# EasyEDA Pro project 数控电源_V3.eprj, schematic 电源板, sheet 2 of 2

## Sheets
2 电源板3: Page Name: 电源板3; Version: V0.32
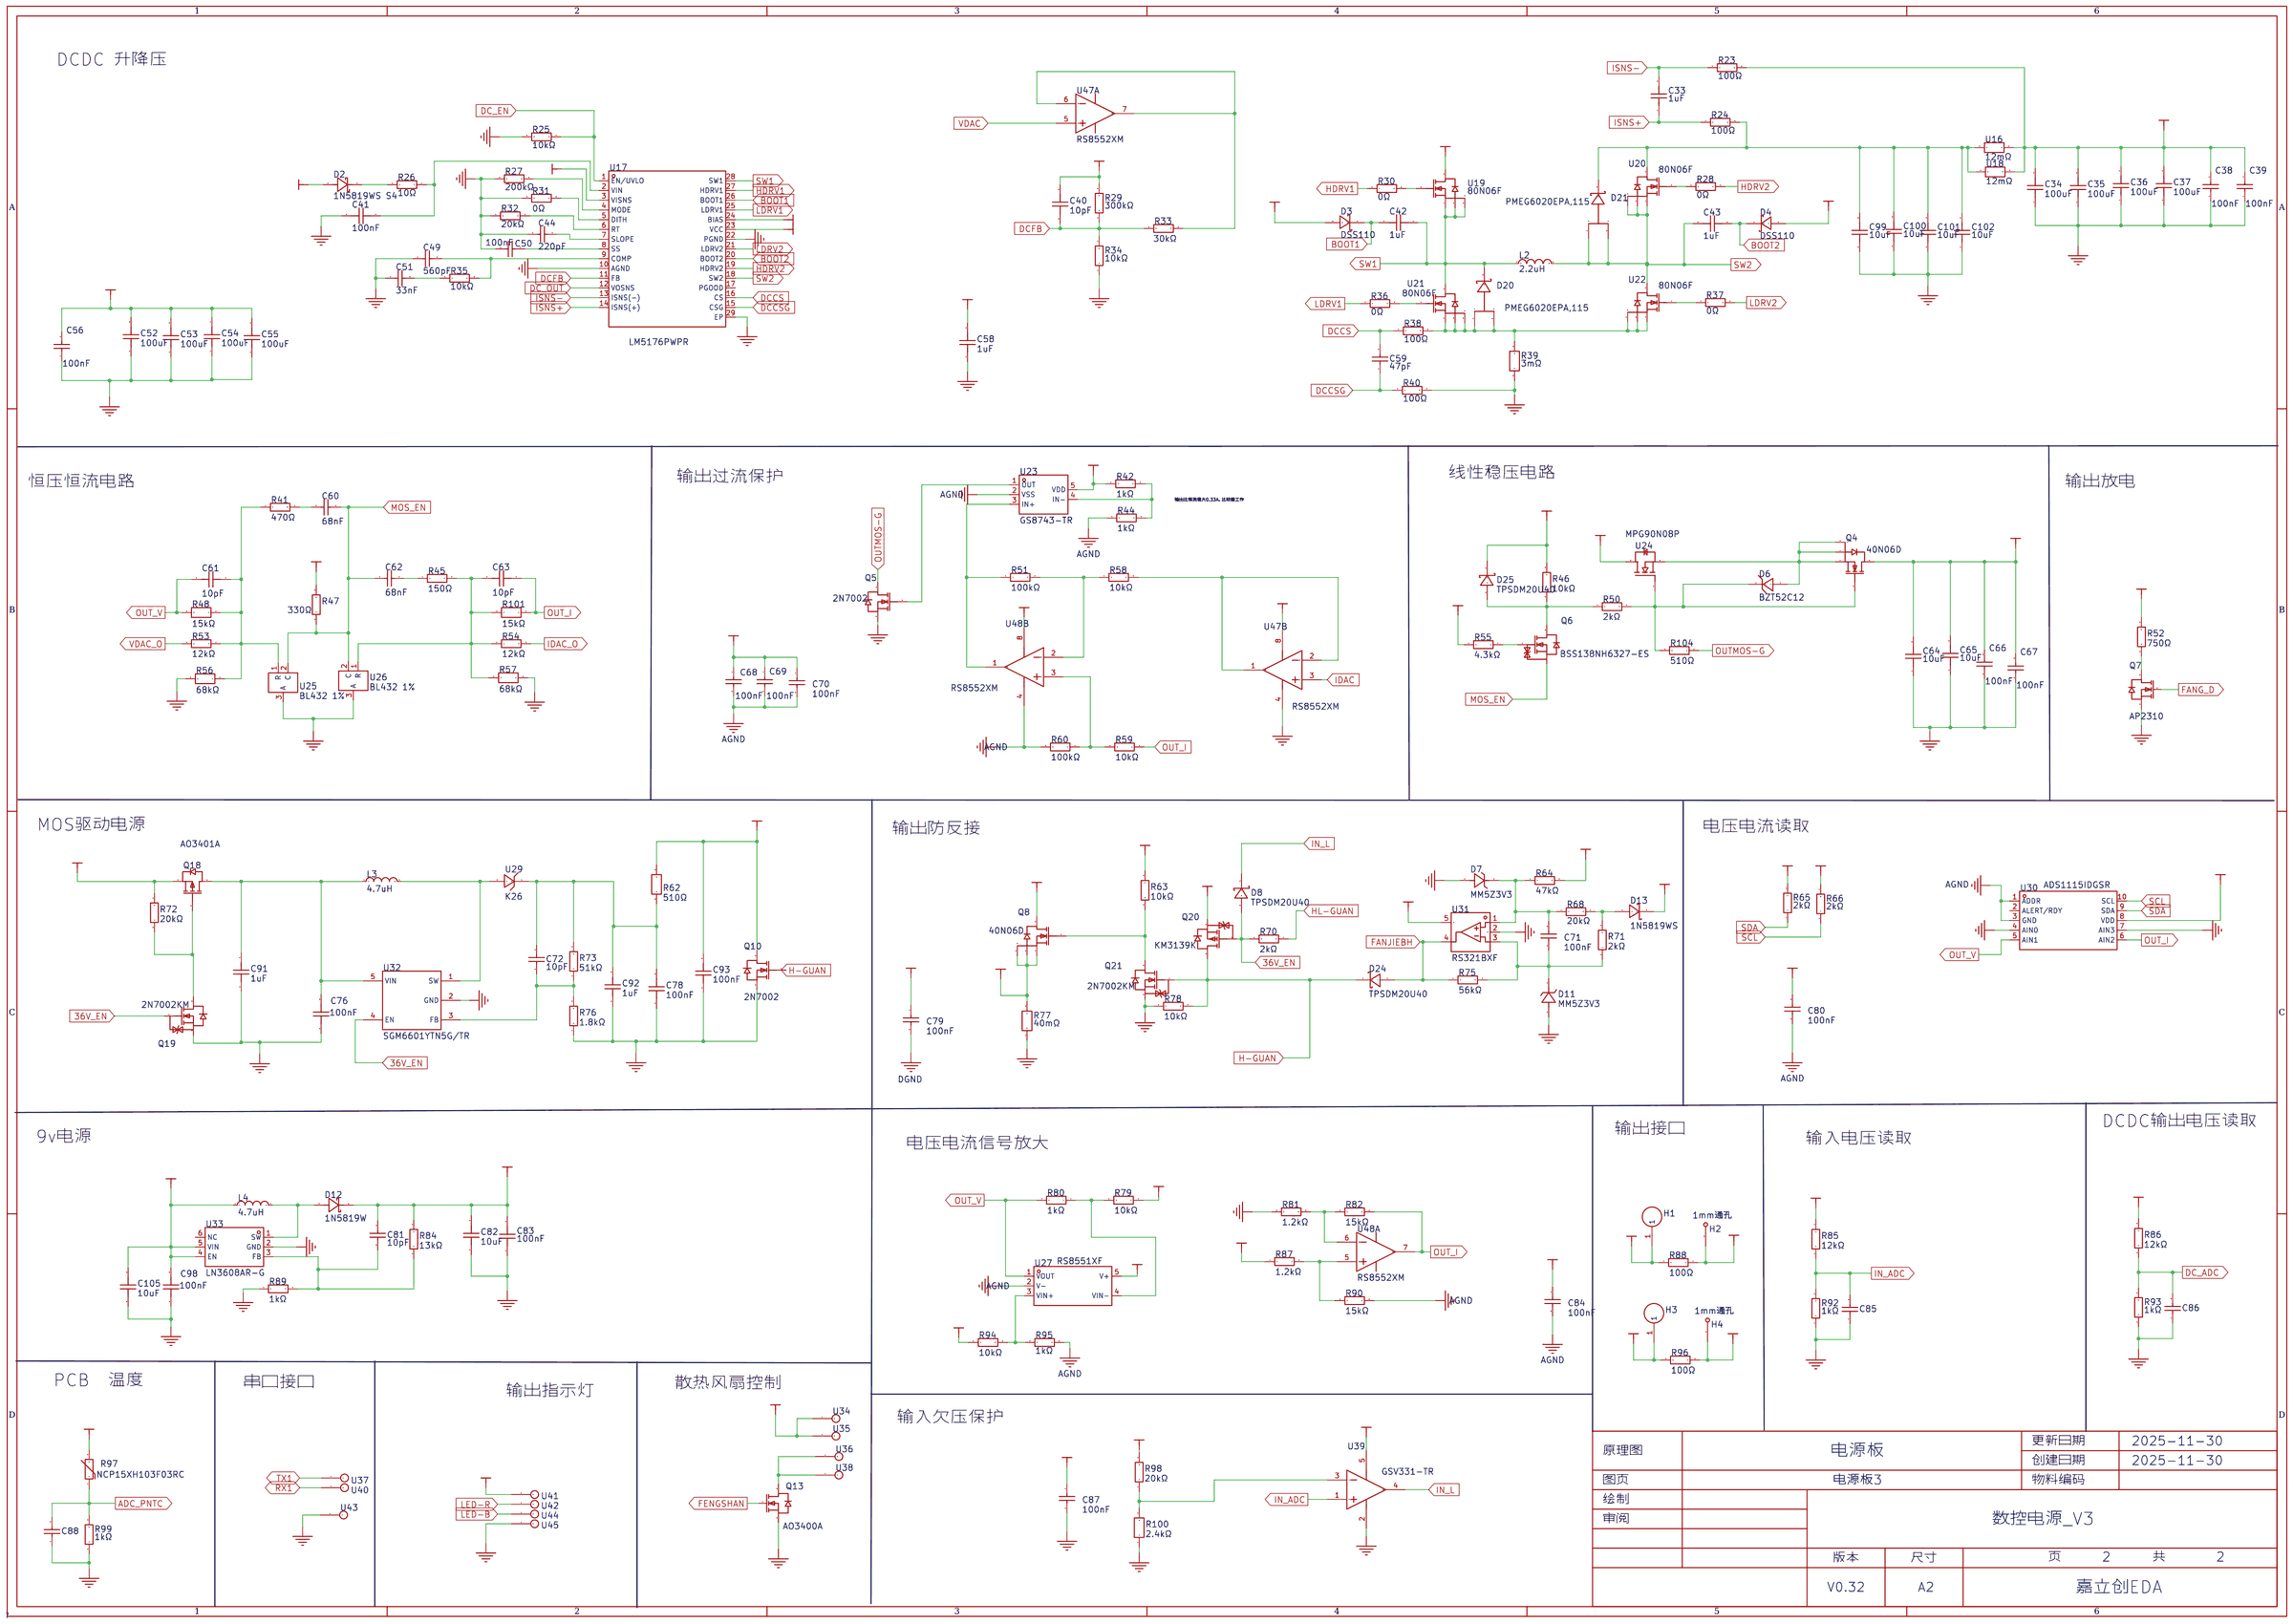
[diagram p4: 电源板3]

## Parts
C33  1uF  [C0603]
C34  100uF  [C1210]
C35  100uF  [C1210]
C36  100uF  [C1210]
C37  100uF  [C1210]
C38  100nF  [C0805]
C39  100nF  [C0805]
C40  10pF  [C0402]
C41  100nF  [C0402]
C42  1uF  [C0603]
C43  1uF  [C0603]
C44  220pF  [C0402]
C49  560pF  [C0402]
C50  100nF  [C0402]
C51  33nF  [C0402]
C52  100uF  [C1210]
C53  100uF  [C1210]
C54  100uF  [C1210]
C55  100uF  [C1210]
C56  100nF  [C0805]
C58  1uF  [C0603]
C59  47pF  [C0402]
C60  68nF  [C0603]
C61  10pF  [C0402]
C62  68nF  [C0603]
C63  10pF  [C0402]
C64  10uF  [C0805]
C65  10uF  [C0805]
C66  100nF  [C0805]
C67  100nF  [C0805]
C68  100nF  [C0402]
C69  100nF  [C0402]
C70  100nF  [C0402]
C71  100nF  [C0402]
C72  10pF  [C0402]
C76  100nF  [C0402]
C78  100nF  [C0402]
C79  100nF  [C0402]
C80  100nF  [C0402]
C81  10pF  [C0402]
C82  10uF  [C0603]
C83  100nF  [C0402]
C84  100nF  [C0402]
C85  100nF  [电容0402]
C86  100nF  [电容0402]
C87  100nF  [C0402]
C88  100nF  [电容0402]
C91  1uF  [C0603]
C92  1uF  [C0603]
C93  100nF  [C0402]
C98  100nF  [C0402]
C99  10uF  [C0805]
C100  10uF  [C0805]
C101  10uF  [C0805]
C102  10uF  [C0805]
C105  10uF  [C0603]
D2  1N5819WS S4  [SOD-323_L1.6-W1.3-LS2.7-RD]
D3  DSS110  [SOD-123_L2.8-W1.8-LS3.7-RD]
D4  DSS110  [SOD-123_L2.8-W1.8-LS3.7-RD]
D6  BZT52C12  [SOD-123_L2.7-W1.6-LS3.7-RD]
D7  MM5Z3V3  [SOD-523_L1.2-W0.8-LS1.6-RD]
D8  TPSDM20U40  [SOD-523_L1.2-W0.8-LS1.6-RD]
D11  MM5Z3V3  [SOD-523_L1.2-W0.8-LS1.6-RD]
D12  1N5819W  [SOD-123_L2.7-W1.6-LS3.7-R-RD]
D13  1N5819WS  [SOD-323_L1.8-W1.3-LS2.5-RD]
D20  PMEG6020EPA,115  [SOT-1061_L2.0-W2.0-P1.30-BR]
D21  PMEG6020EPA,115  [SOT-1061_L2.0-W2.0-P1.30-BR]
D24  TPSDM20U40  [SOD-523_L1.2-W0.8-LS1.6-RD]
D25  TPSDM20U40  [SOD-523_L1.2-W0.8-LS1.6-RD]
H1  -  [DC-2-DIP]
H2  1mm通孔  [DC-1-DIP]
H3  -  [DC-2-DIP]
H4  1mm通孔  [DC-1-DIP]
L2  2.2uH  [IND-SMD_L13.5-W12.8_TMPC1265HP]
L3  4.7uH  [IND-SMD_L3.0-W3.0-1]
L4  4.7uH  [IND-SMD_L3.0-W3.0-1]
Q4  40N06D  [WDFN-5_L3.3-W3.3-P0.65-BL]
Q5  2N7002  [SOT-23-3_L2.9-W1.3-P1.90-LS2.4-BR]
Q6  BSS138NH6327-ES  [SOT-23-3_L2.9-W1.3-P1.90-LS2.4-BR]
Q7  AP2310  [SOT-23-3_L2.9-W1.3-P1.90-LS2.4-BR]
Q8  40N06D  [WDFN-5_L3.3-W3.3-P0.65-BL]
Q10  2N7002  [SOT-23-3_L2.9-W1.3-P1.90-LS2.4-BR]
Q13  AO3400A  [SOT-23-3_L2.9-W1.3-P1.90-LS2.4-BR]
Q18  AO3401A  [SOT-23_L2.9-W1.3-P1.90-LS2.4-BR]
Q19  2N7002KM  [SOT-723-3_L1.2-W0.8-P0.80-LS1.2-BR]
Q20  KM3139K  [SOT-723-3_L1.2-W0.8-P0.80-LS1.2-BR]
Q21  2N7002KM  [SOT-723-3_L1.2-W0.8-P0.80-LS1.2-BR]
R23  100Ω  [R0402]
R24  100Ω  [R0402]
R25  10kΩ  [R0402]
R26  10Ω  [R0603]
R27  200kΩ  [R0402]
R28  0Ω  [R0402]
R29  300kΩ  [R0402]
R30  0Ω  [R0402]
R31  0Ω  [R0402]
R32  20kΩ  [R0402]
R33  30kΩ  [R0402]
R34  10kΩ  [R0402]
R35  10kΩ  [R0402]
R36  0Ω  [R0402]
R37  0Ω  [R0402]
R38  100Ω  [R0402]
R39  3mΩ  [R2512]
R40  100Ω  [R0402]
R41  470Ω  [R0603]
R42  1kΩ  [R0402]
R44  1kΩ  [R0402]
R45  150Ω  [R0603]
R46  10kΩ  [R0603]
R47  330Ω  [R0603]
R48  15kΩ  [R0402]
R50  2kΩ  [R0603]
R51  100kΩ  [R0402]
R52  750Ω  [R1210]
R53  12kΩ  [R0402]
R54  12kΩ  [R0402]
R55  4.3kΩ  [R0402]
R56  68kΩ  [R0402]
R57  68kΩ  [R0402]
R58  10kΩ  [R0402]
R59  10kΩ  [R0402]
R60  100kΩ  [R0402]
R62  510Ω  [R0603]
R63  10kΩ  [R0402]
R64  47kΩ  [R0402]
R65  2kΩ  [R0402]
R66  2kΩ  [R0402]
R68  20kΩ  [R0402]
R70  2kΩ  [R0402]
R71  2kΩ  [R0402]
R72  20kΩ  [R0402]
R73  51kΩ  [R0402]
R75  56kΩ  [R0402]
R76  1.8kΩ  [R0402]
R77  40mΩ  [RES-SMD_L6.4-W3.2-R2512]
R78  10kΩ  [R0402]
R79  10kΩ  [R0402]
R80  1kΩ  [R0402]
R81  1.2kΩ  [R0402]
R82  15kΩ  [R0402]
R84  13kΩ  [R0402]
R85  12kΩ  [R0402]
R86  12kΩ  [R0402]
R87  1.2kΩ  [R0402]
R88  100Ω  [R0603]
R89  1kΩ  [R0402]
R90  15kΩ  [R0402]
R92  1kΩ  [R0402]
R93  1kΩ  [R0402]
R94  10kΩ  [R0402]
R95  1kΩ  [R0402]
R96  100Ω  [R0603]
R97  NCP15XH103F03RC  [R0402]
R98  20kΩ  [R0402]
R99  1kΩ  [R0402]
R100  2.4kΩ  [R0402]
R101  15kΩ  [R0402]
R104  510Ω  [R0603]
U16  12mΩ  [R1206]
U17  LM5176PWPR  [HTSSOP-28_L9.8-W4.5-P0.65-LS6.6-BL-EP]
U18  12mΩ  [R1206]
U19  80N06F  [DFN-5_L4.9-W5.9-P1.27-LS6.2-BL]
U20  80N06F  [DFN-5_L4.9-W5.9-P1.27-LS6.2-BL]
U21  80N06F  [DFN-5_L4.9-W5.9-P1.27-LS6.2-BL]
U22  80N06F  [DFN-5_L4.9-W5.9-P1.27-LS6.2-BL]
U23  GS8743-TR  [SOT-23-5_L2.9-W1.6-P0.95-LS2.8-BL]
U24  MPG90N08P  [TO-220-3_L10.2-W4.6-P2.54-L]
U25  BL432 1%  [SOT-23-3_L2.9-W1.3-P0.95-LS2.4-BR]
U26  BL432 1%  [SOT-23-3_L2.9-W1.3-P0.95-LS2.4-BR]
U27  RS8551XF  [SOT-23-5_L3.0-W1.7-P0.95-LS2.8-BL]
U29  K26  [SOD-123FL_L2.8-W1.8-LS3.8-RD]
U30  ADS1115IDGSR  [MSOP-10_L3.0-W3.0-P0.50-LS5.0-BL]
U31  RS321BXF  [SOT-23-5_L2.9-W1.6-P0.95-LS2.8-BL]
U32  SGM6601YTN5G/TR  [SOT-23-5_L3.0-W1.7-P0.95-LS2.8-BR]
U33  LN3608AR-G  [SOT-23-6_L2.9-W1.6-P0.95-LS2.8-BR]
U34  -  [SMT_0.8*1.5]
U35  -  [SMT_0.8*1.5]
U36  -  [SMT_0.8*1.5]
U37  -  [SMT_0.8*1.5]
U38  -  [SMT_0.8*1.5]
U39  GSV331-TR  [SOT-23-5_L2.9-W1.6-P0.95-LS2.8-BR]
U40  -  [SMT_0.8*1.5]
U41  -  [SMT_0.8*1.5]
U42  -  [SMT_0.8*1.5]
U43  -  [SMT_0.8*1.5]
U44  -  [SMT_0.8*1.5]
U45  -  [SMT_0.8*1.5]
U47  RS8552XM  [MSOP-8_L3.0-W3.0-P0.65-LS4.9-BL]  (sections 1,2)
U48  RS8552XM  [MSOP-8_L3.0-W3.0-P0.65-LS4.9-BL]  (sections 1,2)

## Library data of the parts
C33 = CL10A105KB8NNNC: 容值:1uF;精度:±10%;额定电压:50V;材质(温度系数):X5R;; LCSC Part Name: 1uF ±10% 50V; Supplier Part: C15849; Manufacturer: SAMSUNG(三星); Supplier Footprint: 0603; JLCPCB Part Class: Basic Part; Datasheet: https://atta.szlcsc.com/upload/public/pdf/source/20160103/1457707679084.pdf; Supplier: LCSC; Tolerance: ±10%; Voltage Rated: 50V; Temperature Coefficient: X5R
C34-C37 C52-C55 = CS3225X7R106K500NRL: 容值:10uF;额定电压:50V;材质(温度系数):X7R;; LCSC Part Name: 10uF 50V; Supplier Part: C2918502; Manufacturer: SAMWHA(三和); Supplier Footprint: 1210; JLCPCB Part Class: 扩展库; Datasheet: https://atta.szlcsc.com/upload/public/pdf/source/20230815/D6EC8E8D4948B4151F2C89DF2FF24A45.pdf; Supplier: LCSC; Voltage Rated: 50V; Temperature Coefficient: X7R
C38 C39 C56 C66 C67 = 0805B104K500NT: 容值:100nF;精度:±10%;额定电压:50V;材质(温度系数):X7R;; LCSC Part Name: 100nF ±10% 50V; Supplier Part: C38141; Manufacturer: FH(风华); Supplier Footprint: 0805; JLCPCB Part Class: 扩展库; Datasheet: https://atta.szlcsc.com/upload/public/pdf/source/20200305/C486355_26A10D38EF8C2A5C37091D0039909270.pdf; Supplier: LCSC; Tolerance: ±10%; Voltage Rated: 50V; Temperature Coefficient: X7R
C40 C61 C63 = CL05C100JB5NNNC: 容值:10pF;精度:±5%;额定电压:50V;材质(温度系数):C0G;; LCSC Part Name: 10pF ±5% 50V; Supplier Part: C32949; Manufacturer: SAMSUNG(三星); Supplier Footprint: 0402; JLCPCB Part Class: Basic Part; Datasheet: https://atta.szlcsc.com/upload/public/pdf/source/20160218/1457707763339.pdf; Supplier: LCSC; Tolerance: ±5%; Voltage Rated: 50V; Temperature Coefficient: C0G
C41 C76 C78 C83 C93 C98 = CL05B104KB54PNC: 容值:100nF;精度:±10%;额定电压:50V;材质(温度系数):X7R;; LCSC Part Name: 100nF ±10% 50V; Supplier Part: C307331; Manufacturer: SAMSUNG(三星); Supplier Footprint: 0402; JLCPCB Part Class: Basic Part; Datasheet: https://atta.szlcsc.com/upload/public/pdf/source/20181009/C307331_222F7C870FD3EA5F46F538B483443886.pdf; Supplier: LCSC; Tolerance: ±10%; Voltage Rated: 50V; Temperature Coefficient: X7R
C42 C43 = CC0603KRX7R9BB104: 容值:100nF;精度:±10%;额定电压:50V;材质(温度系数):X7R;; LCSC Part Name: 100nF ±10% 50V; Supplier Part: C14663; Manufacturer: YAGEO(国巨); Supplier Footprint: 0603; JLCPCB Part Class: 基础库; Datasheet: https://atta.szlcsc.com/upload/public/pdf/source/20180910/C282072_33301C7F631E79921B82A8DAC6BCC5B3.pdf; Supplier: LCSC; Tolerance: ±10%; Voltage Rated: 50V; Temperature Coefficient: X7R
C44 = CC0402KRX7R9BB152: 容值:1.5nF;精度:±10%;额定电压:50V;材质(温度系数):X7R;; LCSC Part Name: 1.5nF ±10% 50V; Supplier Part: C107022; Manufacturer: YAGEO(国巨); Supplier Footprint: 0402; JLCPCB Part Class: 扩展库; Datasheet: https://atta.szlcsc.com/upload/public/pdf/source/20170914/C128857_1505359892143968080.pdf; Supplier: LCSC; Tolerance: ±10%; Voltage Rated: 50V; Temperature Coefficient: X7R
C49 = 0402CG101J500NT: 容值:100pF;精度:±5%;额定电压:50V;材质(温度系数):C0G;; LCSC Part Name: 100pF ±5% 50V; Supplier Part: C1546; Manufacturer: FH(风华); Supplier Footprint: 0402; JLCPCB Part Class: 基础库; Datasheet: https://atta.szlcsc.com/upload/public/pdf/source/20200305/C486355_26A10D38EF8C2A5C37091D0039909270.pdf; Supplier: LCSC; Tolerance: ±5%; Voltage Rated: 50V; Temperature Coefficient: C0G
C50 = CC0402KRX7R9BB333: 容值:33nF;精度:±10%;额定电压:50V;材质(温度系数):X7R;; LCSC Part Name: 33nF ±10% 50V; Supplier Part: C106862; Manufacturer: YAGEO(国巨); Supplier Footprint: 0402; JLCPCB Part Class: 扩展库; Datasheet: https://atta.szlcsc.com/upload/public/pdf/source/20170919/C131031_1505787245477976978.pdf; Supplier: LCSC; Tolerance: ±10%; Voltage Rated: 50V; Temperature Coefficient: X7R
C51 = 0402B223K500NT: 容值:22nF;精度:±10%;额定电压:50V;材质(温度系数):X7R;; LCSC Part Name: 22nF ±10% 50V; Supplier Part: C1532; Manufacturer: FH(风华); Supplier Footprint: 0402; JLCPCB Part Class: 基础库; Datasheet: https://atta.szlcsc.com/upload/public/pdf/source/20200305/C486355_26A10D38EF8C2A5C37091D0039909270.pdf; Supplier: LCSC; Tolerance: ±10%; Voltage Rated: 50V; Temperature Coefficient: X7R
C58 C91 C92 = CC0603KRX7R9BB105: 容值:1uF;精度:±10%;额定电压:50V;材质(温度系数):X7R;; LCSC Part Name: 1uF ±10% 50V; Supplier Part: C559769; Manufacturer: YAGEO(国巨); Supplier Footprint: 0603; JLCPCB Part Class: 扩展库; Datasheet: https://atta.szlcsc.com/upload/public/pdf/source/20181031/C325451_C7CF01155AE3010E0D610C52F5FE7D31.pdf; Supplier: LCSC; Tolerance: ±10%; Voltage Rated: 50V; Temperature Coefficient: X7R
C59 = GRM1555C1H470JA01D: 容值:47pF;精度:±5%;额定电压:50V;材质(温度系数):C0G;; LCSC Part Name: 47pF ±5% 50V; Supplier Part: C76970; Manufacturer: muRata(村田); Supplier Footprint: 0402; JLCPCB Part Class: 扩展库; Datasheet: https://atta.szlcsc.com/upload/public/pdf/source/20180326/C76970_6FDF160D4C40A32DF03646FA34DB0595.pdf; Supplier: LCSC; Tolerance: ±5%; Voltage Rated: 50V; Temperature Coefficient: C0G
C60 C62 = CC0603KRX7R9BB683: 容值:68nF;精度:±10%;额定电压:50V;材质(温度系数):X7R;; LCSC Part Name: 68nF ±10% 50V; Supplier Part: C107098; Manufacturer: YAGEO(国巨); Supplier Footprint: 0603; JLCPCB Part Class: 扩展库; Datasheet: https://atta.szlcsc.com/upload/public/pdf/source/20180910/C282072_33301C7F631E79921B82A8DAC6BCC5B3.pdf; Supplier: LCSC; Tolerance: ±10%; Voltage Rated: 50V; Temperature Coefficient: X7R
C64 C65 C99-C102 = HGC0805R5106K500NSLJ: 容值:10uF;精度:±10%;额定电压:50V;温度系数:X5R;; LCSC Part Name: 10uF ±10% 50V; Supplier Part: C22367830; Manufacturer: Chinocera(华瓷); Supplier Footprint: 0805; JLCPCB Part Class: Extended Part; Datasheet: https://atta.szlcsc.com/upload/public/pdf/source/20240326/4C0A3E12027C78BBE9280625046EA2CF.pdf; Supplier: LCSC; Tolerance: ±10%; Voltage Rating: 50V; Temperature Coefficient: X5R
C68-C71 C79 C80 C84 C87 = CC0402KRX7R9BB104: 容值:100nF;精度:±10%;额定电压:50V;材质(温度系数):X7R;; LCSC Part Name: 100nF ±10% 50V; Supplier Part: C131394; Manufacturer: YAGEO(国巨); Supplier Footprint: 0402; JLCPCB Part Class: Extended Part; Datasheet: https://atta.szlcsc.com/upload/public/pdf/source/20170925/C131394_1506321459057990237.pdf; Supplier: LCSC; Tolerance: ±10%; Voltage Rated: 50V; Temperature Coefficient: X7R
C72 C81 = GRM1555C1H100JA01D: 容值:10pF;精度:±5%;额定电压:50V;材质(温度系数):C0G;; LCSC Part Name: 10pF ±5% 50V; Supplier Part: C76946; Manufacturer: muRata(村田); Supplier Footprint: 0402; JLCPCB Part Class: 扩展库; Datasheet: https://atta.szlcsc.com/upload/public/pdf/source/20180307/C76946_15204091154331407734.pdf; Supplier: LCSC; Tolerance: ±5%; Voltage Rated: 50V; Temperature Coefficient: C0G
C82 = HGC0603R5106M160NTHJ: 容值:10uF;精度:±20%;额定电压:16V;温度系数:X5R;; LCSC Part Name: 10uF ±20% 16V; Supplier Part: C7472959; Manufacturer: Chinocera(华瓷); Supplier Footprint: 0603; JLCPCB Part Class: 扩展库; Datasheet: https://atta.szlcsc.com/upload/public/pdf/source/20240320/FAC3FEC40A78BC5CCCE96C232A94D860.pdf; Supplier: LCSC; Tolerance: ±20%; Voltage Rating: 16V; Temperature Coefficient: X5R
C85 C86 C88 = 0402_100nf_50v: 容值:100nF;精度:±10%;额定电压:50V;材质(温度系数):X7R;; LCSC Part Name: 100nF ±10% 50V; Supplier Part: C131394; Manufacturer: YAGEO(国巨); Manufacturer Part: CC0402KRX7R9BB104; Supplier Footprint: 0402; JLCPCB Part Class: 扩展库; Datasheet: https://atta.szlcsc.com/upload/public/pdf/source/20170925/C131394_1506321459057990237.pdf; Supplier: LCSC; Tolerance: ±10%; Voltage Rated: 50V; Temperature Coefficient: X7R
C105 = CGA0603X5R106K100JT: 容值:10uF;精度:±10%;额定电压:10V;温度系数:X5R;; LCSC Part Name: 10uF ±10% 10V; Supplier Part: C6119842; Manufacturer: HRE(芯声); Supplier Footprint: 0603; JLCPCB Part Class: 扩展库; Supplier: LCSC; Tolerance: ±10%; Voltage Rating: 10V; Temperature Coefficient: X5R
D2 = 1N5819WS S4_C2927280: 二极管配置:独立式;正向压降(Vf):600mV@200mA;直流反向耐压(Vr):40V;平均整流电流(Io):350mA;; LCSC Part Name: 电压:40V 电流:350mA; Supplier Part: C2927280; Manufacturer: JSMSEMI(杰盛微); Supplier Footprint: SOD-323; JLCPCB Part Class: Extended Part; Datasheet: https://atta.szlcsc.com/upload/public/pdf/source/20240105/574E572B69D2DF1CD36E5C05FAB269C4.pdf; Supplier: LCSC; Diode Configuration: 独立式; Forward Voltage (Vf@If): 600mV@200mA; Reverse Voltage (Vr): 40V; Average Rectified Current (Io): 350mA; Reverse Leakage Current (Ir): 5uA@30V
D3 D4 = DSS110: 正向压降(Vf):850mV@2A;直流反向耐压(Vr):100V;平均整流电流(Io):1A;; LCSC Part Name: 电压:100V 电流:1A; Supplier Part: C511869; Manufacturer: BORN(伯恩半导体); Supplier Footprint: SOD-123; JLCPCB Part Class: 扩展库; Datasheet: https://atta.szlcsc.com/upload/public/pdf/source/20200413/C511869_4B1777B2C9E012B37F3CCB340178476C.pdf; Supplier: LCSC; Forward Voltage (Vf@If): 850mV@2A; Reverse Voltage (Vr): 100V; Average Rectified Current (Io): 1A
D6 = BZT52C12_C173429: 二极管配置:独立式;稳压值(标称值):12V;稳压值(范围):11.4V~12.7V;耗散功率(Pd):500mW;; Supplier Part: C173429; Manufacturer: MDD(辰达半导体); Supplier Footprint: SOD-123; JLCPCB Part Class: Extended Part; Datasheet: https://atta.szlcsc.com/upload/public/pdf/source/20241121/F5439B697EC7888E343325F3F630C595.pdf; Supplier: LCSC; Diode Configuration: 独立式; Zener Voltage (Nom): 12V; Reverse Leakage Current (Ir): 100nA@9V; Zener Voltage (Range): 11.4V~12.7V; Power Dissipation: 500mW; Zener Impedance (Zzt): 25Ω; Zener Voltage(Nom): 12V; Zener Voltage(Range): 11.4V~12.7V; Pd - Power Dissipation(Pd): 500mW; Impedance(Zzt): 35Ω
D7 D11 = MM5Z3V3_C2891760: 二极管配置:独立式;稳压值(标称值):3.3V;稳压值(范围):3.1V~3.5V;功率(Pd):150mW;; Supplier Part: C2891760; Manufacturer: YONGYUTAI(永裕泰); Supplier Footprint: SOD-523; JLCPCB Part Class: Extended Part; Datasheet: https://atta.szlcsc.com/upload/public/pdf/source/20210901/454AC8DA820FB08C17B8C511DC6019A5.pdf; Supplier: LCSC; Diode Configuration: 独立式; Zener Voltage (Nom): 3.3V; Zener Voltage (Range): 3.1V~3.5V; Power Dissipation: 150mW; Zener Impedance (Zzt): 95Ω
D8 D24 D25 = TPSDM20U40: 正向压降(Vf):600mV@200mA;直流反向耐压(Vr):40V;整流电流:350mA;; Supplier Part: C48886839; Manufacturer: TECH PUBLIC(台舟); Supplier Footprint: SOD-523; JLCPCB Part Class: Extended Part; Datasheet: https://atta.szlcsc.com/upload/public/pdf/source/20250509/9FEC9DF30CB865A402E2A7B28D5BA719.pdf; Supplier: LCSC; Voltage - Forward(Vf@If): 600mV@200mA; Voltage - DC Reverse(Vr): 40V; Current - Rectified: 350mA; Reverse Leakage Current (Ir): 5uA@30V; Operating Junction Temperature Range: -40℃~+125℃; Non-Repetitive Peak Forward Surge Current: 2A
D12 = 1N5819W_C963381: 二极管配置:独立式;正向压降(Vf):600mV@200mA;直流反向耐压(Vr):40V;平均整流电流(Io):350mA;; LCSC Part Name: 电压:40V 电流:350mA; Supplier Part: C963381; Manufacturer: JSMSEMI(杰盛微); Supplier Footprint: SOD-123; JLCPCB Part Class: 扩展库; Datasheet: https://atta.szlcsc.com/upload/public/pdf/source/20230807/ADD53622154D5B572F84A7B877E922CE.pdf; Supplier: LCSC; Diode Configuration: 独立式; Forward Voltage (Vf@If): 600mV@200mA; Reverse Voltage (Vr): 40V; Average Rectified Current (Io): 350mA; Reverse Leakage Current (Ir): 5uA@30V
D13 = 1N5819WS_C191023: 正向压降(Vf):600mV@1A;直流反向耐压(Vr):40V;整流电流:1A;; LCSC Part Name: 电压:40V 电流:1A; Supplier Part: C191023; Manufacturer: Hottech(合科泰); Supplier Footprint: SOD-323; JLCPCB Part Class: 基础库; Datasheet: https://atta.szlcsc.com/upload/public/pdf/source/20220428/3CB86FD8D28D653594B4E35F9D5AEFD9.pdf; Supplier: LCSC; Forward Voltage (Vf@If): 600mV@1A; Reverse Voltage (Vr): 40V; Rectified Current: 1A
D20 D21 = PMEG6020EPA,115: 正向压降(Vf):575mV@2A;直流反向耐压(Vr):60V;整流电流:2A;; LCSC Part Name: 电压:60V 电流:2A; Supplier Part: C552939; Manufacturer: Nexperia(安世); Supplier Footprint: SOT-1061; JLCPCB Part Class: 扩展库; Datasheet: https://atta.szlcsc.com/upload/public/pdf/source/20200610/C552939_DBFAE7045B17BE2EDE29198091673D60.pdf; Supplier: LCSC; Voltage - Forward(Vf@If): 575mV@2A; Voltage - DC Reverse(Vr): 60V; Current - Rectified: 2A
H1 H3 = DC-2-DIP: 单个焊接通孔
H2 H4 = DC-1-DIP: 孔径1mm通孔
L2 = TMPC1265HP-4R7MG-D: 电感值:4.7uH;精度:±20%;额定电流:13.5A;; LCSC Part Name: 4.7uH ±20%; Supplier Part: C305225; Manufacturer: TAI-TECH(台庆); Supplier Footprint: SMD; JLCPCB Part Class: 扩展库; Datasheet: https://atta.szlcsc.com/upload/public/pdf/source/20200917/C305225_26BCD18F23EE507F7AF3A2399E0D6DFB.pdf; Supplier: LCSC; Tolerance: ±20%; Rated Current: 13.5A; DC Resistance (DCR): 7mΩ
L3 L4 = ANR3015T4R7M: 电感值:4.7uH;精度:±20%;额定电流:1.11A;饱和电流(Isat):1.12A;类型:磁胶屏蔽绕线电感;; LCSC Part Name: 4.7uH ±20% 1.12A; Supplier Part: C7427089; Manufacturer: APV(爱普微); Supplier Footprint: SMD,3x3mm; JLCPCB Part Class: 扩展库; Datasheet: https://atta.szlcsc.com/upload/public/pdf/source/20230920/8B21AEAFB8742CA79E47C90276D2A04D.pdf; Supplier: LCSC; Tolerance: ±20%; Current Rating: 1.11A; Current - Saturation(Isat): 1.12A; Type: 磁胶屏蔽绕线电感
Q4 Q8 = 40N06D: 类型:1个N沟道;漏源电压(Vdss):60V;连续漏极电流(Id):40A;导通电阻(RDS(on)@Vgs,Id):12mΩ;阈值电压(Vgs(th)@Id):2.5V;; LCSC Part Name: 1个N沟道 耐压:60V 电流:40A; Supplier Part: C7543836; Manufacturer: HL(富海微); Supplier Footprint: PDFN-8(3x3); JLCPCB Part Class: 扩展库; Datasheet: https://atta.szlcsc.com/upload/public/pdf/source/20230825/07A9036E800E141F359495D1306C7959.pdf; Supplier: LCSC; Type: 1个N沟道; Drain Source Voltage (Vdss): 60V; Continuous Drain Current (Id): 40A; Drain Source On Resistance (RDS(on)@Vgs,Id): 12mΩ; Gate Threshold Voltage (Vgs(th)@Id): 2.5V
Q5 Q10 = 2N7002_C8545: 类型:N沟道;漏源电压(Vdss):60V;连续漏极电流(Id):115mA;功率(Pd):200mW;导通电阻(RDS(on)@Vgs,Id):7.5Ω@10V,500mA;阈值电压(Vgs(th)@Id):2.5V@250uA;; LCSC Part Name: N沟道 耐压:60V 电流:115mA; Supplier Part: C8545; Manufacturer: CJ(江苏长电/长晶); Supplier Footprint: SOT-23; JLCPCB Part Class: 基础库; Datasheet: https://atta.szlcsc.com/upload/public/pdf/source/20171228/C164913_15144413269051213916.pdf; Supplier: LCSC; Type: N沟道; Drain Source Voltage (Vdss): 60V; Continuous Drain Current (Id): 115mA; Power Dissipation (Pd): 200mW; Drain Source On Resistance (RDS(on)@Vgs,Id): 7.5Ω@10V,500mA; Gate Threshold Voltage (Vgs(th)@Id): 2.5V@250uA
Q6 = BSS138NH6327-ES: 类型:1个N沟道;漏源电压(Vdss):60V;连续漏极电流(Id):300mA;导通电阻(RDS(on)@Vgs,Id):2Ω@4.5V;功率(Pd):350mW;阈值电压(Vgs(th)@Id):1V@250uA;; LCSC Part Name: 1个N沟道 耐压:50V 电流:300mA; Supplier Part: C5224270; Manufacturer: ElecSuper(静芯微); Supplier Footprint: SOT-23; JLCPCB Part Class: 扩展库; Datasheet: https://atta.szlcsc.com/upload/public/pdf/source/20240905/406F54CC0987F20EB5965938EA1C9DA5.pdf; Supplier: LCSC; Type: 1个N沟道; Drain Source Voltage (Vdss): 60V; Continuous Drain Current (Id): 300mA; Drain Source On Resistance (RDS(on)@Vgs,Id): 2Ω@4.5V; Power Dissipation (Pd): 350mW; Gate Threshold Voltage (Vgs(th)@Id): 1V@250uA; Total Gate Charge (Qg@Vgs): 1.6nC@4.5V; Input Capacitance (Ciss@Vds): 15pF; Reverse Transfer Capacitance (Crss@Vds): 1.3pF@25V; Operating Temperature: -55℃~+150℃
Q7 = AP2310: 类型:1个N沟道;漏源电压(Vdss):60V;连续漏极电流(Id):3A;功率(Pd):1.7W;导通电阻(RDS(on)@Vgs,Id):105mΩ@10V,3A;阈值电压(Vgs(th)@Id):1.4V@250uA;; LCSC Part Name: 1个N沟道 耐压:60V 电流:3A; Supplier Part: C353087; Manufacturer: ALLPOWER(铨力); Supplier Footprint: SOT-23-3L; JLCPCB Part Class: 扩展库; Datasheet: https://atta.szlcsc.com/upload/public/pdf/source/20211013/A26EA736C08E0EE7EA5FEC6AECA6A1C6.pdf; Supplier: LCSC; Type: 1个N沟道; Drain Source Voltage (Vdss): 60V; Continuous Drain Current (Id): 3A; Power Dissipation (Pd): 1.7W; Drain Source On Resistance (RDS(on)@Vgs,Id): 105mΩ@10V,3A; Gate Threshold Voltage (Vgs(th)@Id): 1.4V@250uA
Q13 = AO3400A_C347475: Supplier Part: C347475; Manufacturer: UMW(友台半导体); Supplier Footprint: SOT-23; JLCPCB Part Class: Extended Part; Datasheet: https://atta.szlcsc.com/upload/public/pdf/source/20190827/C347475_40CAF14D9CD0153436F5DC917B39143D.pdf; Supplier: LCSC
Q18 = AO3401A_C15127: 类型:1个P沟道;漏源电压(Vdss):30V;连续漏极电流(Id):4A;导通电阻(RDS(on)@Vgs,Id):44mΩ@10V,4.3A;功率(Pd):1.4W;阈值电压(Vgs(th)@Id):1.3V@250uA;; LCSC Part Name: 1个P沟道 耐压:30V 电流:4A; Supplier Part: C15127; Manufacturer: AOS; Supplier Footprint: SOT-23; JLCPCB Part Class: 基础库; Datasheet: https://atta.szlcsc.com/upload/public/pdf/source/20160507/1462613609053.pdf; Supplier: LCSC; Type: 1个P沟道; Drain Source Voltage (Vdss): 30V; Continuous Drain Current (Id): 4A; Drain Source On Resistance (RDS(on)@Vgs,Id): 44mΩ@10V,4.3A; Power Dissipation (Pd): 1.4W; Gate Threshold Voltage (Vgs(th)@Id): 1.3V@250uA; Total Gate Charge (Qg@Vgs): 12.2nC@4.5V; Input Capacitance (Ciss@Vds): 1.2nF@15V; Operating Temperature: -55℃~+150℃@(Tj)
Q19 Q21 = 2N7002KM_C7528888: 数量:1个N沟道;漏源电压(Vdss):60V;连续漏极电流(Id):340mA;导通电阻(RDS(on)):1.3Ω@10V,500mA;耗散功率(Pd):150mW;阈值电压(Vgs(th)):1V;; LCSC Part Name: N沟道,电流:0.34A,耐压:60V; Supplier Part: C7528888; Manufacturer: AM(安美); Supplier Footprint: SOT-723; JLCPCB Part Class: 扩展库; Datasheet: https://atta.szlcsc.com/upload/public/pdf/source/20231129/5C66841134DDA0BD991D299F08DBA333.pdf; Supplier: LCSC; Number: 1个N沟道; Drain to Source Voltage: 60V; Current - Continuous Drain(Id): 340mA; RDS(on): 1.3Ω@10V,500mA; Pd - Power Dissipation: 150mW; Gate Threshold Voltage (Vgs(th)@Id): 1V; Input Capacitance(Ciss@Vds): 40pF@10V; Reverse Transfer Capacitance (Crss@Vds): 10pF@10V; Operating Temperature: -55℃~+150℃
Q20 = KM3139K: 类型:1个P沟道;漏源电压(Vdss):20V;连续漏极电流(Id):660mA;导通电阻(RDS(on)):510mΩ@4.5V,0.5A;耗散功率(Pd):150mW;阈值电压(Vgs(th)):350mV;; LCSC Part Name: 1个P沟道 耐压:20V 电流:660mA; Supplier Part: C5438457; Manufacturer: KUU; Supplier Footprint: SOT-723; JLCPCB Part Class: 扩展库; Datasheet: https://atta.szlcsc.com/upload/public/pdf/source/20230323/8B1C1A174AF6A3C9021ECCCCA3FA0A34.pdf; Supplier: LCSC; Type: 1个P沟道; Drain to Source Voltage: 20V; Current - Continuous Drain(Id): 660mA; RDS(on): 510mΩ@4.5V,0.5A; Pd - Power Dissipation: 150mW; Gate Threshold Voltage (Vgs(th)@Id): 350mV; Gate Charge(Qg): 1.24nC@4.5V; Input Capacitance(Ciss@Vds): 113pF@16V; Reverse Transfer Capacitance (Crss@Vds): 9pF@16V; Operating Temperature: -55℃~+150℃@(Tj)
R23 R24 R38 R40 = RC0402FR-07100RL: 电阻类型:厚膜电阻;阻值:100Ω;精度:±1%;功率:62.5mW;温度系数:±100ppm/℃;最大工作电压:50V;工作温度范围:-55℃~+155℃;; LCSC Part Name: 100Ω ±1% 62.5mW; Supplier Part: C106232; Manufacturer: YAGEO(国巨); Supplier Footprint: 0402; JLCPCB Part Class: Extended Part; Datasheet: https://atta.szlcsc.com/upload/public/pdf/source/20170518/1495085712869.pdf; Supplier: LCSC; Type: 厚膜电阻; Tolerance: ±1%; Power(Watts): 62.5mW; Temperature Coefficient: ±100ppm/℃; Overload Voltage (Max): 50V; Operating Temperature Range: -55℃~+155℃
R25 R34 R35 R58 R59 R63 R78 R79 R94 = RC0402FR-0710KL: 电阻类型:厚膜电阻;阻值:10kΩ;精度:±1%;功率:62.5mW;; LCSC Part Name: 10kΩ ±1% 62.5mW; Supplier Part: C60490; Manufacturer: YAGEO(国巨); Supplier Footprint: 0402; JLCPCB Part Class: Extended Part; Datasheet: https://atta.szlcsc.com/upload/public/pdf/source/20170606/1496716515432.pdf; Supplier: LCSC; Type: 厚膜电阻; Tolerance: ±1%; Power(Watts): 62.5mW; Temperature Coefficient: ±100ppm/℃; Overload Voltage (Max): 50V; Operating Temperature Range: -55℃~+155℃
R26 = 0603WAF100JT5E: 电阻类型:厚膜电阻;阻值:10Ω;精度:±1%;功率:100mW;最大工作电压:75V;温度系数:±400ppm/℃;; LCSC Part Name: 10Ω ±1% 100mW 厚膜电阻; Supplier Part: C22859; Manufacturer: UNI-ROYAL(厚声); Supplier Footprint: 0603; JLCPCB Part Class: Basic Part; Datasheet: https://atta.szlcsc.com/upload/public/pdf/source/20200306/C422600_1E6D84923E4A46A82E41ADD87F860B5C.pdf; Supplier: LCSC; Type: 厚膜电阻; Tolerance: ±1%; Power(Watts): 100mW; Overload Voltage (Max): 75V; Temperature Coefficient: ±400ppm/℃; Operating Temperature Range: -55℃~+155℃
R27 = RC0402FR-0791KL: 电阻类型:厚膜电阻;阻值:91kΩ;精度:±1%;功率:62.5mW;工作电压:50V;温度系数:±100ppm/℃;; LCSC Part Name: 厚膜电阻 91kΩ ±1% 62.5mW; Supplier Part: C327323; Manufacturer: YAGEO(国巨); Supplier Footprint: 0402; JLCPCB Part Class: Extended Part; Datasheet: https://atta.szlcsc.com/upload/public/pdf/source/20250610/89E4D743C004A82A45145C7A2CC3A578.pdf; Supplier: LCSC; Type: 厚膜电阻; Tolerance: ±1%; Power(Watts): 62.5mW; Voltage-Supply(Max): 50V; Temperature Coefficient: ±100ppm/℃; Operating Temperature: -55℃~+155℃
R28 R30 R36 R37 = 0402WGF100KTCE: 电阻类型:厚膜电阻;阻值:1Ω;精度:±1%;功率:62.5mW;最大工作电压:50V;温度系数:±200ppm/℃;; LCSC Part Name: 1Ω ±1% 62.5mW 厚膜电阻; Supplier Part: C25086; Manufacturer: UNI-ROYAL(厚声); Supplier Footprint: 0402; JLCPCB Part Class: 扩展库; Datasheet: https://atta.szlcsc.com/upload/public/pdf/source/20200306/C422600_1E6D84923E4A46A82E41ADD87F860B5C.pdf; Supplier: LCSC; Type: 厚膜电阻; Tolerance: ±1%; Power(Watts): 62.5mW; Overload Voltage (Max): 50V; Temperature Coefficient: ±200ppm/℃; Operating Temperature Range: -55℃~+155℃
R29 R68 = 0402WGF3003TCE: 电阻类型:厚膜电阻;阻值:300kΩ;精度:±1%;功率:62.5mW;最大工作电压:50V;温度系数:±100ppm/℃;; LCSC Part Name: 300kΩ ±1% 62.5mW 厚膜电阻; Supplier Part: C25774; Manufacturer: UNI-ROYAL(厚声); Supplier Footprint: 0402; JLCPCB Part Class: 扩展库; Datasheet: https://atta.szlcsc.com/upload/public/pdf/source/20200306/C422600_1E6D84923E4A46A82E41ADD87F860B5C.pdf; Supplier: LCSC; Type: 厚膜电阻; Tolerance: ±1%; Power(Watts): 62.5mW; Overload Voltage (Max): 50V; Temperature Coefficient: ±100ppm/℃; Operating Temperature Range: -55℃~+155℃
R31 = 0402WGF0000TCE: 电阻类型:厚膜电阻;阻值:0Ω;精度:±1%;功率:62.5mW;温度系数:±800ppm/℃;最大工作电压:50V;工作温度范围:-55℃~+155℃;; LCSC Part Name: 0Ω ±1% 62.5mW; Supplier Part: C17168; Manufacturer: UNI-ROYAL(厚声); Supplier Footprint: 0402; JLCPCB Part Class: Basic Part; Datasheet: https://atta.szlcsc.com/upload/public/pdf/source/20200306/C422600_1E6D84923E4A46A82E41ADD87F860B5C.pdf; Supplier: LCSC; Type: 厚膜电阻; Tolerance: ±1%; Power(Watts): 62.5mW; Temperature Coefficient: ±800ppm/℃; Overload Voltage (Max): 50V; Operating Temperature Range: -55℃~+155℃
R32 = 0402WGF6202TCE: 电阻类型:厚膜电阻;阻值:62kΩ;精度:±1%;功率:62.5mW;工作电压:50V;温度系数:±100ppm/℃;; LCSC Part Name: 62kΩ ±1% 62.5mW 厚膜电阻; Supplier Part: C37825; Manufacturer: UNI-ROYAL(厚声); Supplier Footprint: 0402; JLCPCB Part Class: Extended Part; Datasheet: https://atta.szlcsc.com/upload/public/pdf/source/20200306/C422600_1E6D84923E4A46A82E41ADD87F860B5C.pdf; Supplier: LCSC; Type: 厚膜电阻; Tolerance: ±1%; Power(Watts): 62.5mW; Voltage-Supply(Max): 50V; Temperature Coefficient: ±100ppm/℃; Operating Temperature: -55℃~+155℃
R33 = 0402WGF2402TCE: 电阻类型:厚膜电阻;阻值:24kΩ;精度:±1%;功率:62.5mW;最大工作电压:50V;温度系数:±100ppm/℃;; LCSC Part Name: 24kΩ ±1% 62.5mW 厚膜电阻; Supplier Part: C25769; Manufacturer: UNI-ROYAL(厚声); Supplier Footprint: 0402; JLCPCB Part Class: 扩展库; Datasheet: https://atta.szlcsc.com/upload/public/pdf/source/20200306/C422600_1E6D84923E4A46A82E41ADD87F860B5C.pdf; Supplier: LCSC; Type: 厚膜电阻; Tolerance: ±1%; Power(Watts): 62.5mW; Overload Voltage (Max): 50V; Temperature Coefficient: ±100ppm/℃; Operating Temperature Range: -55℃~+155℃
R39 = LR2512D-3W-3mR-1%: 电阻类型:采样电阻;阻值:3mΩ;精度:±1%;功率:3W;温度系数:25ppm/℃~+50ppm/℃;安装方式:贴片;; LCSC Part Name: 3mΩ ±1% 3W; Supplier Part: C500737; Manufacturer: Milliohm(毫欧); Supplier Footprint: 2512; JLCPCB Part Class: 扩展库; Datasheet: https://atta.szlcsc.com/upload/public/pdf/source/20211008/27BCB003066C6550DC06C87D8395239C.pdf; Supplier: LCSC; Type: 采样电阻; Tolerance: ±1%; Power(Watts): 3W; Temperature Coefficient: 25ppm/℃~+50ppm/℃; Mounting Sytle: 贴片
R41 R45 = 0603WAF1001T5E: 电阻类型:厚膜电阻;阻值:1kΩ;精度:±1%;功率:100mW;; LCSC Part Name: 1kΩ ±1% 100mW; Supplier Part: C21190; Manufacturer: UNI-ROYAL(厚声); Supplier Footprint: 0603; JLCPCB Part Class: Basic Part; Datasheet: https://atta.szlcsc.com/upload/public/pdf/source/20200306/C422600_1E6D84923E4A46A82E41ADD87F860B5C.pdf; Supplier: LCSC; Type: 厚膜电阻; Tolerance: ±1%; Power(Watts): 100mW; Temperature Coefficient: ±100ppm/℃; Overload Voltage (Max): 75V; Operating Temperature Range: -55℃~+155℃
R42 R44 R80 R89 R92 R93 R95 = 0402WGF1001TCE: 电阻类型:厚膜电阻;阻值:1kΩ;精度:±1%;功率:62.5mW;温度系数:±100ppm/℃;最大工作电压:50V;工作温度范围:-55℃~+155℃;; LCSC Part Name: 1kΩ ±1% 62.5mW; Supplier Part: C11702; Manufacturer: UNI-ROYAL(厚声); Supplier Footprint: 0402; JLCPCB Part Class: Basic Part; Datasheet: https://atta.szlcsc.com/upload/public/pdf/source/20200306/C422600_1E6D84923E4A46A82E41ADD87F860B5C.pdf; Supplier: LCSC; Type: 厚膜电阻; Tolerance: ±1%; Power(Watts): 62.5mW; Temperature Coefficient: ±100ppm/℃; Overload Voltage (Max): 50V; Operating Temperature Range: -55℃~+155℃
R46 = RC0603FR-0710KL: 电阻类型:厚膜电阻;阻值:10kΩ;精度:±1%;功率:100mW;最大工作电压:75V;温度系数:±100ppm/℃;; LCSC Part Name: 厚膜电阻 10kΩ ±1% 100mW; Supplier Part: C98220; Manufacturer: YAGEO(国巨); Supplier Footprint: 0603; JLCPCB Part Class: 扩展库; Datasheet: https://atta.szlcsc.com/upload/public/pdf/source/20180927/C295883_E8D83085EA81BD7DE0B2B681138C15EE.pdf; Supplier: LCSC; Type: 厚膜电阻; Tolerance: ±1%; Power(Watts): 100mW; Overload Voltage (Max): 75V; Temperature Coefficient: ±100ppm/℃; Operating Temperature Range: -55℃~+155℃
R47 = 0603WAF3300T5E: 电阻类型:厚膜电阻;阻值:330Ω;精度:±1%;功率:100mW;最大工作电压:75V;温度系数:±100ppm/℃;; LCSC Part Name: 330Ω ±1% 100mW 厚膜电阻; Supplier Part: C23138; Manufacturer: UNI-ROYAL(厚声); Supplier Footprint: 0603; JLCPCB Part Class: Basic Part; Datasheet: https://atta.szlcsc.com/upload/public/pdf/source/20200306/C422600_1E6D84923E4A46A82E41ADD87F860B5C.pdf; Supplier: LCSC; Type: 厚膜电阻; Tolerance: ±1%; Power(Watts): 100mW; Overload Voltage (Max): 75V; Temperature Coefficient: ±100ppm/℃; Operating Temperature Range: -55℃~+155℃
R48 R82 R90 R101 = 0402WGF1502TCE: 电阻类型:厚膜电阻;阻值:15kΩ;精度:±1%;功率:62.5mW;最大工作电压:50V;温度系数:±100ppm/℃;; LCSC Part Name: 15kΩ ±1% 62.5mW 厚膜电阻; Supplier Part: C25756; Manufacturer: UNI-ROYAL(厚声); Supplier Footprint: 0402; JLCPCB Part Class: Basic Part; Datasheet: https://atta.szlcsc.com/upload/public/pdf/source/20200306/C422600_1E6D84923E4A46A82E41ADD87F860B5C.pdf; Supplier: LCSC; Power(Watts): 62.5mW; Tolerance: ±1%; Temperature Coefficient: ±100ppm/℃; Overload Voltage (Max): 50V; Operating Temperature Range: -55℃~+155℃; Type: 厚膜电阻
R50 = 0603WAF2001T5E: 电阻类型:厚膜电阻;阻值:2kΩ;精度:±1%;功率:100mW;最大工作电压:75V;温度系数:±100ppm/℃;; LCSC Part Name: 2kΩ ±1% 100mW 厚膜电阻; Supplier Part: C22975; Manufacturer: UNI-ROYAL(厚声); Supplier Footprint: 0603; JLCPCB Part Class: Basic Part; Datasheet: https://atta.szlcsc.com/upload/public/pdf/source/20200306/C422600_1E6D84923E4A46A82E41ADD87F860B5C.pdf; Supplier: LCSC; Type: 厚膜电阻; Tolerance: ±1%; Power(Watts): 100mW; Overload Voltage (Max): 75V; Temperature Coefficient: ±100ppm/℃; Operating Temperature Range: -55℃~+155℃
R51 R60 = RC0402FR-07100KL: 电阻类型:厚膜电阻;阻值:100kΩ;精度:±1%;功率:62.5mW;; LCSC Part Name: 100kΩ ±1% 62.5mW; Supplier Part: C60491; Manufacturer: YAGEO(国巨); Supplier Footprint: 0402; JLCPCB Part Class: Extended Part; Datasheet: https://atta.szlcsc.com/upload/public/pdf/source/20170518/1495086055123.pdf; Supplier: LCSC; Type: 厚膜电阻; Tolerance: ±1%; Power(Watts): 62.5mW; Temperature Coefficient: ±100ppm/℃; Overload Voltage (Max): 50V; Operating Temperature Range: -55℃~+155℃
R52 = FRC1210F7500TS: 电阻类型:厚膜电阻;阻值:750Ω;精度:±1%;功率:500mW;工作电压:200V;温度系数:±100ppm/℃;; LCSC Part Name: 厚膜电阻 750Ω ±1% 500mW; Supplier Part: C2999576; Manufacturer: FOJAN(富捷); Supplier Footprint: 1210; JLCPCB Part Class: Extended Part; Datasheet: https://atta.szlcsc.com/upload/public/pdf/source/20240815/E4F1531D1C60085E6B84901F2C57F42A.pdf; Supplier: LCSC; Type: 厚膜电阻; Tolerance: ±1%; Power(Watts): 500mW; Voltage-Supply(Max): 200V; Temperature Coefficient: ±100ppm/℃
R53 R54 = 0402WGF1202TCE: 电阻类型:厚膜电阻;阻值:12kΩ;精度:±1%;功率:62.5mW;最大工作电压:50V;温度系数:±100ppm/℃;; LCSC Part Name: 12kΩ ±1% 62.5mW 厚膜电阻; Supplier Part: C25752; Manufacturer: UNI-ROYAL(厚声); Supplier Footprint: 0402; JLCPCB Part Class: Basic Part; Datasheet: https://atta.szlcsc.com/upload/public/pdf/source/20200306/C422600_1E6D84923E4A46A82E41ADD87F860B5C.pdf; Supplier: LCSC; Tolerance: ±1%; Power(Watts): 62.5mW; Overload Voltage (Max): 50V; Temperature Coefficient: ±100ppm/℃; Type: 厚膜电阻; Operating Temperature Range: -55℃~+155℃
R55 = RC0402FR-074K3L: 电阻类型:厚膜电阻;阻值:4.3kΩ;精度:±1%;功率:62.5mW;最大工作电压:50V;温度系数:±100ppm/℃;; LCSC Part Name: 厚膜电阻 4.3kΩ ±1% 62.5mW; Supplier Part: C477725; Manufacturer: YAGEO(国巨); Supplier Footprint: 0402; JLCPCB Part Class: Extended Part; Datasheet: https://atta.szlcsc.com/upload/public/pdf/source/20200715/C477725_E333BDE2C5CB132A02254653ABDDF8CA.pdf; Supplier: LCSC; Type: 厚膜电阻; Tolerance: ±1%; Power(Watts): 62.5mW; Overload Voltage (Max): 50V; Temperature Coefficient: ±100ppm/℃; Operating Temperature Range: -55℃~+155℃
R56 R57 = RC0402FR-0768KL: 电阻类型:厚膜电阻;阻值:68kΩ;精度:±1%;功率:62.5mW;工作电压:50V;温度系数:±100ppm/℃;; LCSC Part Name: 厚膜电阻 68kΩ ±1% 62.5mW; Supplier Part: C137947; Manufacturer: YAGEO(国巨); Supplier Footprint: 0402; JLCPCB Part Class: Extended Part; Datasheet: https://atta.szlcsc.com/upload/public/pdf/source/20250610/89E4D743C004A82A45145C7A2CC3A578.pdf; Supplier: LCSC; Type: 厚膜电阻; Tolerance: ±1%; Power(Watts): 62.5mW; Voltage-Supply(Max): 50V; Temperature Coefficient: ±100ppm/℃; Operating Temperature: -55℃~+155℃
R62 = FRC0603J511 TS: 电阻类型:厚膜电阻;阻值:510Ω;精度:±5%;功率:100mW;最大工作电压:75V;温度系数:±100ppm/℃;; LCSC Part Name: 510Ω ±5% 100mW 厚膜电阻; Supplier Part: C2907179; Manufacturer: FOJAN(富捷); Supplier Footprint: 0603; JLCPCB Part Class: 扩展库; Datasheet: https://atta.szlcsc.com/upload/public/pdf/source/20211221/925EC7D7225764EE0046F22065062C87.pdf; Supplier: LCSC; Type: 厚膜电阻; Tolerance: ±5%; Power(Watts): 100mW; Overload Voltage (Max): 75V; Temperature Coefficient: ±100ppm/℃; Operating Temperature Range: -55℃~+155℃
R64 = 0402WGF2002TCE: 电阻类型:厚膜电阻;阻值:20kΩ;精度:±1%;功率:62.5mW;; LCSC Part Name: 20kΩ ±1% 62.5mW; Supplier Part: C25765; Manufacturer: UNI-ROYAL(厚声); Supplier Footprint: 0402; JLCPCB Part Class: 基础库; Datasheet: https://atta.szlcsc.com/upload/public/pdf/source/20200306/C422600_1E6D84923E4A46A82E41ADD87F860B5C.pdf; Supplier: LCSC; Type: 厚膜电阻; Tolerance: ±1%; Power(Watts): 62.5mW; Temperature Coefficient: ±100ppm/℃; Overload Voltage (Max): 50V; Operating Temperature Range: -55℃~+155℃
R65 R66 = FRC0402F2001TS: 电阻类型:厚膜电阻;阻值:2kΩ;精度:±1%;功率:62.5mW;工作电压:50V;温度系数:±100ppm/℃;; LCSC Part Name: 2kΩ ±1% 62.5mW 厚膜电阻; Supplier Part: C2909344; Manufacturer: FOJAN(富捷); Supplier Footprint: 0402; JLCPCB Part Class: Extended Part; Datasheet: https://atta.szlcsc.com/upload/public/pdf/source/20211221/925EC7D7225764EE0046F22065062C87.pdf; Supplier: LCSC; Type: 厚膜电阻; Tolerance: ±1%; Power(Watts): 62.5mW; Overload Voltage (Max): 50V; Temperature Coefficient: ±100ppm/℃; Operating Temperature Range: -55℃~+155℃; Voltage-Supply(Max): 50V; Operating Temperature: -55℃~+155℃
R70 = 0402WGF2001TCE: 电阻类型:厚膜电阻;阻值:2kΩ;精度:±1%;功率:62.5mW;最大工作电压:50V;温度系数:±100ppm/℃;; LCSC Part Name: 2kΩ ±1% 62.5mW 厚膜电阻; Supplier Part: C4109; Manufacturer: UNI-ROYAL(厚声); Supplier Footprint: 0402; JLCPCB Part Class: Basic Part; Datasheet: https://atta.szlcsc.com/upload/public/pdf/source/20200306/C422600_1E6D84923E4A46A82E41ADD87F860B5C.pdf; Supplier: LCSC; Type: 厚膜电阻; Tolerance: ±1%; Power(Watts): 62.5mW; Temperature Coefficient: ±100ppm/℃; Overload Voltage (Max): 50V; Operating Temperature Range: -55℃~+155℃
R71 = 0402WGF2001TCE: 电阻类型:厚膜电阻;阻值:2kΩ;精度:±1%;功率:62.5mW;温度系数:±100ppm/℃;最大工作电压:50V;工作温度范围:-55℃~+155℃;; LCSC Part Name: 2kΩ ±1% 62.5mW; Supplier Part: C4109; Manufacturer: UNI-ROYAL(厚声); Supplier Footprint: 0402; JLCPCB Part Class: Basic Part; Datasheet: https://atta.szlcsc.com/upload/public/pdf/source/20200306/C422600_1E6D84923E4A46A82E41ADD87F860B5C.pdf; Supplier: LCSC; Type: 厚膜电阻; Tolerance: ±1%; Power(Watts): 62.5mW; Temperature Coefficient: ±100ppm/℃; Overload Voltage (Max): 50V; Operating Temperature Range: -55℃~+155℃
R72 = 0402WGF2002TCE: 电阻类型:厚膜电阻;阻值:20kΩ;精度:±1%;功率:62.5mW;最大工作电压:50V;温度系数:±100ppm/℃;; LCSC Part Name: 20kΩ ±1% 62.5mW 厚膜电阻; Supplier Part: C25765; Manufacturer: UNI-ROYAL(厚声); Supplier Footprint: 0402; JLCPCB Part Class: Basic Part; Datasheet: https://atta.szlcsc.com/upload/public/pdf/source/20200306/C422600_1E6D84923E4A46A82E41ADD87F860B5C.pdf; Supplier: LCSC; Type: 厚膜电阻; Tolerance: ±1%; Power(Watts): 62.5mW; Temperature Coefficient: ±100ppm/℃; Overload Voltage (Max): 50V; Operating Temperature Range: -55℃~+155℃
R73 = 0402WGF5102TCE: 电阻类型:厚膜电阻;阻值:51kΩ;精度:±1%;功率:62.5mW;最大工作电压:50V;温度系数:±100ppm/℃;; LCSC Part Name: 51kΩ ±1% 62.5mW 厚膜电阻; Supplier Part: C25794; Manufacturer: UNI-ROYAL(厚声); Supplier Footprint: 0402; JLCPCB Part Class: Basic Part; Datasheet: https://atta.szlcsc.com/upload/public/pdf/source/20200306/C422600_1E6D84923E4A46A82E41ADD87F860B5C.pdf; Supplier: LCSC; Type: 厚膜电阻; Tolerance: ±1%; Power(Watts): 62.5mW; Overload Voltage (Max): 50V; Temperature Coefficient: ±100ppm/℃; Operating Temperature Range: -55℃~+155℃
R75 = 0402WGF1004TCE: 电阻类型:厚膜电阻;阻值:1MΩ;精度:±1%;功率:62.5mW;最大工作电压:50V;温度系数:±100ppm/℃;; LCSC Part Name: 1MΩ ±1% 62.5mW 厚膜电阻; Supplier Part: C26083; Manufacturer: UNI-ROYAL(厚声); Supplier Footprint: 0402; JLCPCB Part Class: Basic Part; Datasheet: https://atta.szlcsc.com/upload/public/pdf/source/20200306/C422600_1E6D84923E4A46A82E41ADD87F860B5C.pdf; Supplier: LCSC; Type: 厚膜电阻; Tolerance: ±1%; Power(Watts): 62.5mW; Overload Voltage (Max): 50V; Temperature Coefficient: ±100ppm/℃; Operating Temperature Range: -55℃~+155℃
R76 = 0402WGF1801TCE: 电阻类型:厚膜电阻;阻值:1.8kΩ;精度:±1%;功率:62.5mW;工作电压:50V;温度系数:±100ppm/℃;; LCSC Part Name: 1.8kΩ ±1% 62.5mW 厚膜电阻; Supplier Part: C25871; Manufacturer: UNI-ROYAL(厚声); Supplier Footprint: 0402; JLCPCB Part Class: Extended Part; Datasheet: https://atta.szlcsc.com/upload/public/pdf/source/20200306/C422600_1E6D84923E4A46A82E41ADD87F860B5C.pdf; Supplier: LCSC; Type: 厚膜电阻; Tolerance: ±1%; Power(Watts): 62.5mW; Voltage-Supply(Max): 50V; Temperature Coefficient: ±100ppm/℃; Operating Temperature: -55℃~+155℃
R77 = HoJLR2512-3W-10mR-1%: 电阻类型:采样电阻;阻值:10mΩ;精度:±1%;功率:3W;安装方式:贴片;; LCSC Part Name: 10mΩ ±1% 3W; Supplier Part: C2903468; Manufacturer: Milliohm(毫欧); Supplier Footprint: 2512; JLCPCB Part Class: 扩展库; Datasheet: https://atta.szlcsc.com/upload/public/pdf/source/20211009/7525CABAB363C979E942C1DD41F1FEF0.pdf; Supplier: LCSC; Type: 采样电阻; Tolerance: ±1%; Power(Watts): 3W; Mounting Sytle: 贴片
R81 R87 = FRC0402F1201TS: 电阻类型:厚膜电阻;阻值:1.2kΩ;精度:±1%;功率:62.5mW;最大工作电压:50V;温度系数:±100ppm/℃;; LCSC Part Name: 1.2kΩ ±1% 62.5mW 厚膜电阻; Supplier Part: C2909307; Manufacturer: FOJAN(富捷); Supplier Footprint: 0402; JLCPCB Part Class: Extended Part; Datasheet: https://atta.szlcsc.com/upload/public/pdf/source/20211221/925EC7D7225764EE0046F22065062C87.pdf; Supplier: LCSC; Type: 厚膜电阻; Tolerance: ±1%; Power(Watts): 62.5mW; Overload Voltage (Max): 50V; Temperature Coefficient: ±100ppm/℃; Operating Temperature Range: -55℃~+155℃
R84 = RT0402BRD0713KL: 电阻类型:薄膜电阻;阻值:13kΩ;精度:±0.1%;功率:62.5mW;温度系数:±25ppm/℃;; LCSC Part Name: 薄膜电阻 13kΩ ±0.1% 62.5mW; Supplier Part: C852524; Manufacturer: YAGEO(国巨); Supplier Footprint: 0402; JLCPCB Part Class: Extended Part; Datasheet: https://atta.szlcsc.com/upload/public/pdf/source/20200610/C326738_5639A9F1B6EB6E4AE2197577D3456E7F.pdf; Supplier: LCSC; Type: 薄膜电阻; Tolerance: ±0.1%; Power(Watts): 62.5mW; Temperature Coefficient: ±25ppm/℃; Operating Temperature Range: -55℃~+155℃
R85 R86 = 0402WGF1202TCE: 阻值:12kΩ;精度:±1%;功率:62.5mW;温度系数:±100ppm/℃;电阻类型:厚膜电阻;; LCSC Part Name: 12kΩ ±1% 62.5mW 厚膜电阻; Supplier Part: C25752; Manufacturer: UNI-ROYAL(厚声); Supplier Footprint: 0402; JLCPCB Part Class: Basic Part; Datasheet: https://atta.szlcsc.com/upload/public/pdf/source/20200306/C422600_1E6D84923E4A46A82E41ADD87F860B5C.pdf; Supplier: LCSC; Tolerance: ±1%; Power(Watts): 62.5mW; Overload Voltage (Max): 50V; Temperature Coefficient: ±100ppm/℃; Type: 厚膜电阻; Operating Temperature Range: -55℃~+155℃
R88 R96 = 0603WAF100JT5E: 电阻类型:厚膜电阻;阻值:10Ω;精度:±1%;功率:100mW;最大工作电压:75V;温度系数:±400ppm/℃;; LCSC Part Name: 10Ω ±1% 100mW 厚膜电阻; Supplier Part: C22859; Manufacturer: UNI-ROYAL(厚声); Supplier Footprint: 0603; JLCPCB Part Class: 基础库; Datasheet: https://atta.szlcsc.com/upload/public/pdf/source/20200306/C422600_1E6D84923E4A46A82E41ADD87F860B5C.pdf; Supplier: LCSC; Type: 厚膜电阻; Tolerance: ±1%; Power(Watts): 100mW; Overload Voltage (Max): 75V; Temperature Coefficient: ±400ppm/℃; Operating Temperature Range: -55℃~+155℃
R97 = NCP15XH103F03RC: 阻值(25℃):10kΩ;电阻精度:±1%;B值精度:±1%;B值(25℃/50℃):3380K;功率:100mW;最大稳态电流(25℃):310uA;B值(25℃/75℃):-;B值(25℃/85℃):3334K;B值(25℃/100℃):3455K;工作温度:-40℃~+125℃;; LCSC Part Name: 10kΩ 电阻精度:±1% 3380K; Supplier Part: C77131; Manufacturer: muRata(村田); Supplier Footprint: 0402; JLCPCB Part Class: Extended Part; Datasheet: https://atta.szlcsc.com/upload/public/pdf/source/20161024/1477288428169.pdf; Supplier: LCSC; Resistance @ 25℃: 10kΩ; Resistance Tolerance: ±1%; B Constant Tolerance: ±1%; B Constant (25℃/50℃): 3380K; Power: 100mW; Steady State Current (Max): 310uA; B Constant (25℃/85℃): 3334K; B Constant (25℃/100℃): 3455K; Operating Temperature: -40℃~+125℃
R98 = FRC0402F2002TS: 电阻类型:厚膜电阻;阻值:20kΩ;精度:±1%;功率:62.5mW;最大工作电压:50V;温度系数:±100ppm/℃;; LCSC Part Name: 20kΩ ±1% 62.5mW 厚膜电阻; Supplier Part: C2906867; Manufacturer: FOJAN(富捷); Supplier Footprint: 0402; JLCPCB Part Class: Extended Part; Datasheet: https://atta.szlcsc.com/upload/public/pdf/source/20211221/925EC7D7225764EE0046F22065062C87.pdf; Supplier: LCSC; Type: 厚膜电阻; Tolerance: ±1%; Power(Watts): 62.5mW; Overload Voltage (Max): 50V; Temperature Coefficient: ±100ppm/℃; Operating Temperature Range: -55℃~+155℃
R99 = 0402WGF1001TCE: 电阻类型:厚膜电阻;阻值:1kΩ;精度:±1%;功率:62.5mW;; LCSC Part Name: 1kΩ ±1% 62.5mW; Supplier Part: C11702; Manufacturer: UNI-ROYAL(厚声); Supplier Footprint: 0402; JLCPCB Part Class: Basic Part; Datasheet: https://atta.szlcsc.com/upload/public/pdf/source/20200306/C422600_1E6D84923E4A46A82E41ADD87F860B5C.pdf; Supplier: LCSC; Type: 厚膜电阻; Tolerance: ±1%; Power(Watts): 62.5mW; Temperature Coefficient: ±100ppm/℃; Overload Voltage (Max): 50V; Operating Temperature Range: -55℃~+155℃
R100 = 0402WGF2401TCE: 电阻类型:厚膜电阻;阻值:2.4kΩ;精度:±1%;功率:62.5mW;最大工作电压:50V;温度系数:±100ppm/℃;; LCSC Part Name: 2.4kΩ ±1% 62.5mW 厚膜电阻; Supplier Part: C25882; Manufacturer: UNI-ROYAL(厚声); Supplier Footprint: 0402; JLCPCB Part Class: Extended Part; Datasheet: https://atta.szlcsc.com/upload/public/pdf/source/20200306/C422600_1E6D84923E4A46A82E41ADD87F860B5C.pdf; Supplier: LCSC; Type: 厚膜电阻; Tolerance: ±1%; Power(Watts): 62.5mW; Overload Voltage (Max): 50V; Temperature Coefficient: ±100ppm/℃; Operating Temperature Range: -55℃~+155℃
R104 = 0603WAF5100T5E: 电阻类型:厚膜电阻;阻值:510Ω;精度:±1%;功率:100mW;最大工作电压:75V;温度系数:±100ppm/℃;; LCSC Part Name: 510Ω ±1% 100mW 厚膜电阻; Supplier Part: C23193; Manufacturer: UNI-ROYAL(厚声); Supplier Footprint: 0603; JLCPCB Part Class: Basic Part; Datasheet: https://atta.szlcsc.com/upload/public/pdf/source/20200306/C422600_1E6D84923E4A46A82E41ADD87F860B5C.pdf; Supplier: LCSC; Type: 厚膜电阻; Tolerance: ±1%; Power(Watts): 100mW; Overload Voltage (Max): 75V; Temperature Coefficient: ±100ppm/℃; Operating Temperature Range: -55℃~+155℃
U16 U18 = HoLLR1206-1W-5mR-1%: 电阻类型:采样电阻;阻值:5mΩ;精度:±1%;额定压降:-;功率:1W;温度系数:±50ppm/℃;安装方式:贴片;; LCSC Part Name: 5mΩ ±1% 1W; Supplier Part: C2988648; Manufacturer: Milliohm(毫欧); Supplier Footprint: 1206; JLCPCB Part Class: 扩展库; Datasheet: https://atta.szlcsc.com/upload/public/pdf/source/20220407/F189C92CC2C10DCB4BF36375122B9E11.pdf; Supplier: LCSC; Type: 采样电阻; Tolerance: ±1%; Power(Watts): 1W; Rated Current: 31.6A; Temperature Coefficient: ±50ppm/℃; Mounting Sytle: 贴片
U17 = LM5176PWPR: 功能类型:升降压型;输出类型:-;工作电压:4.2V~55V;输出电压:-;输出电流:-;; LCSC Part Name: 四开关同步升降压控制器; Supplier Part: C442493; Manufacturer: TI(德州仪器); Supplier Footprint: HTSSOP-28-EP; JLCPCB Part Class: Extended Part; Datasheet: https://www.ti.com/cn/lit/gpn/lm5176; Supplier: LCSC; Function: 升降压型; Voltage - Supply: 4.2V~55V; Frequency - Switching: 600kHz; Operating Temperature: -40℃~+125℃@(TJ); Synchronous Rectifier: 是; Number of Outputs: 1; Topology: 降压式；升压式
U19-U22 = 80N06F: 类型:1个N沟道;漏源电压(Vdss):60V;连续漏极电流(Id):80A;导通电阻(RDS(on)@Vgs,Id):6mΩ;阈值电压(Vgs(th)@Id):4V;; LCSC Part Name: 1个N沟道 耐压:60V 电流:80A; Supplier Part: C7543837; Manufacturer: HL(富海微); Supplier Footprint: PDFN-8-EP(5x6); JLCPCB Part Class: 扩展库; Datasheet: https://atta.szlcsc.com/upload/public/pdf/source/20230904/6AB7A6F3EFE1300642D7D41EE669AE8D.pdf; Supplier: LCSC; Type: 1个N沟道; Drain Source Voltage (Vdss): 60V; Continuous Drain Current (Id): 80A; Drain Source On Resistance (RDS(on)@Vgs,Id): 6mΩ; Gate Threshold Voltage (Vgs(th)@Id): 4V
U23 = GS8743-TR: 输入失调电压(Vos):5mV;输入偏置电流(Ib):6pA;; Supplier Part: C840038; Manufacturer: Gainsil(聚洵); Supplier Footprint: SOT-23-5; JLCPCB Part Class: Extended Part; Datasheet: https://atta.szlcsc.com/upload/public/pdf/source/20220610/7FF7DEA8E5DC250034723D64D42D186D.pdf; Supplier: LCSC; Input Offset Voltage (Vos): 5mV; Input Bias Current (Ib): 6pA; Propagation Delay Time: 6ns; Input Hysteresis Voltage (Vhys): 3mV; Common Mode Rejection Ratio (CMRR): 77dB; Supply Voltage: 2.7V~5.5V; Output Type: 推挽; Supply Current: 1.3mA; Operating Temperature: -40℃~+85℃
U24 = MPG90N08P: 类型:1个N沟道;漏源电压(Vdss):80V;连续漏极电流(Id):90A;导通电阻(RDS(on)@Vgs,Id):9mΩ@10V,35A;功率(Pd):147W;阈值电压(Vgs(th)@Id):2V@250uA;; LCSC Part Name: 1个N沟道 耐压:80V 电流:90A; Supplier Part: C5452765; Manufacturer: minos(迈诺斯); Supplier Footprint: TO-220; JLCPCB Part Class: Extended Part; Datasheet: https://atta.szlcsc.com/upload/public/pdf/source/20231024/AA5095305BC4811CFB12B97D8001E229.pdf; Supplier: LCSC; Type: 1个N沟道; Drain Source Voltage (Vdss): 80V; Continuous Drain Current (Id): 90A; Drain Source On Resistance (RDS(on)@Vgs,Id): 9mΩ@10V,35A; Power Dissipation (Pd): 147W; Gate Threshold Voltage (Vgs(th)@Id): 2V@250uA; Total Gate Charge (Qg@Vgs): 85nC@10V; Input Capacitance (Ciss@Vds): 3.95nF; Reverse Transfer Capacitance (Crss@Vds): 210pF; Operating Temperature: -55℃~+175℃@(Tj)
U25 U26 = BL432 1%: 工作电压:1.24V;; Supplier Part: C21882608; Manufacturer: GME(银河微电); Supplier Footprint: SOT-23; JLCPCB Part Class: 扩展库; Datasheet: https://atta.szlcsc.com/upload/public/pdf/source/20240312/5686880CA3A6C40A7EB50AC01F00AAD4.pdf; Supplier: LCSC; Voltage - Supply: 1.24V; Minimum Cathode Current for Regulation: 100mA; Operating Temperature: 0℃~+70℃
U27 = RS8551XF: 放大器组数:1;增益带宽积(GBP):4.5MHz;压摆率(SR):2.7V/us;; LCSC Part Name: 精密运放RS8551XF; Supplier Part: C237000; Manufacturer: RUNIC(润石); Supplier Footprint: SOT-23-5; JLCPCB Part Class: 扩展库; Datasheet: https://atta.szlcsc.com/upload/public/pdf/source/20180629/C237000_38ED3E90E6DECC01EFA221BA15E46E31.pdf; Supplier: LCSC; Number of Circuits: 1; Gain Bandwidth Product(GBP): 4.5MHz; Slew Rate(SR): 2.7V/us; Supply Voltage: 2.7V~5.5V; Operating Temperature: -40℃~+125℃
U29 = K26: 二极管配置:独立式;正向压降(Vf):550mV@2A;直流反向耐压(Vr):60V;整流电流:2A;; LCSC Part Name: 电压:60V 电流:2A; Supplier Part: C2922179; Manufacturer: GOODWORK(固得沃克); Supplier Footprint: SOD-123FL; JLCPCB Part Class: 扩展库; Datasheet: https://atta.szlcsc.com/upload/public/pdf/source/20240805/235E38988DA680C47E13FC13F6530C9B.pdf; Supplier: LCSC; Diode Configuration: 独立式; Voltage - Forward(Vf@If): 550mV@2A; Voltage - DC Reverse(Vr): 60V; Current - Rectified: 2A; Reverse Leakage Current (Ir): 100uA
U30 = ADS1115IDGSR: 接口:I2C;电源电压:2V~5.5V;采样率:860Hz;分辨率:16位;; LCSC Part Name: 具有内部基准、振荡器和可编程比较器且兼容 I2C 的ADS111x、超小型、低功耗 860SPS、16位ADC; Supplier Part: C37593; Manufacturer: TI(德州仪器); Supplier Footprint: VSSOP-10; JLCPCB Part Class: 扩展库; Datasheet: https://www.ti.com/cn/lit/gpn/ads1115; Supplier: LCSC; Interface: I2C; differential input: 是; number of channels: 2; Supply Voltage: 2V~5.5V; sampling frequency: 860Hz; resolution: 16位; Operating Temperature: -40℃~+125℃
U31 = RS321BXF: 放大器组数:1;增益带宽积(GBP):1.1MHz;压摆率(SR):0.5V/us;; LCSC Part Name: 通用运放RS321BXF; Supplier Part: C237022; Manufacturer: RUNIC(润石); Supplier Footprint: SOT-23-5; JLCPCB Part Class: Extended Part; Datasheet: https://atta.szlcsc.com/upload/public/pdf/source/20180911/C237022_73504F9A4FD65FF905DAE39DA626C7E3.pdf; Supplier: LCSC; Number of Circuits: 1; Gain Bandwidth Product(GBP): 1.1MHz; Slew Rate(SR): 0.5V/us; Supply Current: 80uA
U32 = SGM6601YTN5G/TR: 功能类型:升压型;工作电压:1.8V~6V;输出电压:38V;输出电流:400mA;; LCSC Part Name: 低功耗DC-DC升压转换器; Supplier Part: C84574; Manufacturer: SGMICRO(圣邦微); Supplier Footprint: SOT-23-5; JLCPCB Part Class: 扩展库; Datasheet: https://atta.szlcsc.com/upload/public/pdf/source/20170510/1494407693659.pdf; Supplier: LCSC; Function: 升压型; Voltage - Supply: 1.8V~6V; Output Voltage: 38V; Output Current: 400mA; Frequency - Switching: 1MHz; Operating Temperature: -40℃~+85℃; Number of Outputs: 1; Topology: 升压式; Switch tube (built-in/external): 内置
U33 = LN3608AR-G: Supplier Part: C497425; Manufacturer: natlinear(南麟); Supplier Footprint: SOT-23-6; JLCPCB Part Class: 扩展库; Datasheet: https://atta.szlcsc.com/upload/public/pdf/source/20200316/C497425_674C470496C6F87EF28D70AB67521DA6.pdf; Supplier: LCSC
U34-U38 U40-U45 = smt_0.8*1.5
U39 = GSV331-TR: 输入失调电压(Vos):3mV;输入偏置电流(Ib):6pA;; Supplier Part: C2927687; Manufacturer: Gainsil(聚洵); Supplier Footprint: SOT-23-5; JLCPCB Part Class: 扩展库; Datasheet: https://atta.szlcsc.com/upload/public/pdf/source/20221020/ADBB439231FFA71FE0D291176569A221.pdf; Supplier: LCSC; Input Offset Voltage (Vos): 3mV; Input Bias Current (Ib): 6pA; Propagation Delay Time: 77.5ns; Input Hysteresis Voltage (Vhys): 6mV; Common Mode Rejection Ratio (CMRR): 70dB; Supply Voltage: 1.8V~5.5V; Output Type: 推挽; Supply Current: 46uA; Operating Temperature: -40℃~+85℃
U47 U48 = RS8552XM: 放大器组数:2;增益带宽积(GBP):4.5MHz;压摆率(SR):2.5V/us;; Supplier Part: C236998; Manufacturer: RUNIC(润石); Supplier Footprint: MSOP-8; JLCPCB Part Class: 扩展库; Datasheet: https://atta.szlcsc.com/upload/public/pdf/source/20180704/C236998_2EA4A60C035D21B482DEA1E435D9107D.pdf; Supplier: LCSC; Number of Circuits: 2; Gain Bandwidth Product(GBP): 4.5MHz; Slew Rate(SR): 2.5V/us; Supply Voltage: 2.7V~5.5V; Operating Temperature: -40℃~+125℃

## Nets
36V_EN: D8.2(A) Q19.1(G) Q20.1(G) R70.2 U32.4(EN)
+3.3V: C79.1 C87.1 Q20.2(S) R65.2 R66.2 R98.2 U31.5(+V) U39.5(VDD) ; also on sheet 1
+4.8V: C98.2 C105.2 L4.1 Q18.2(S) R72.1 U33.4(EN) U33.5(VIN) U34.1 U35.1 U41.1 ; also on sheet 1
+9V: C81.2 C82.2 C83.2 D12.2(C) R63.2 R84.2 U17.24(BIAS)
+36V: C93.2 D25.1(K) Q10.3(D) R46.2 R62.1
